# Altium schematic sheet cell_level_protection.SchDoc
size 420 x 297 mm
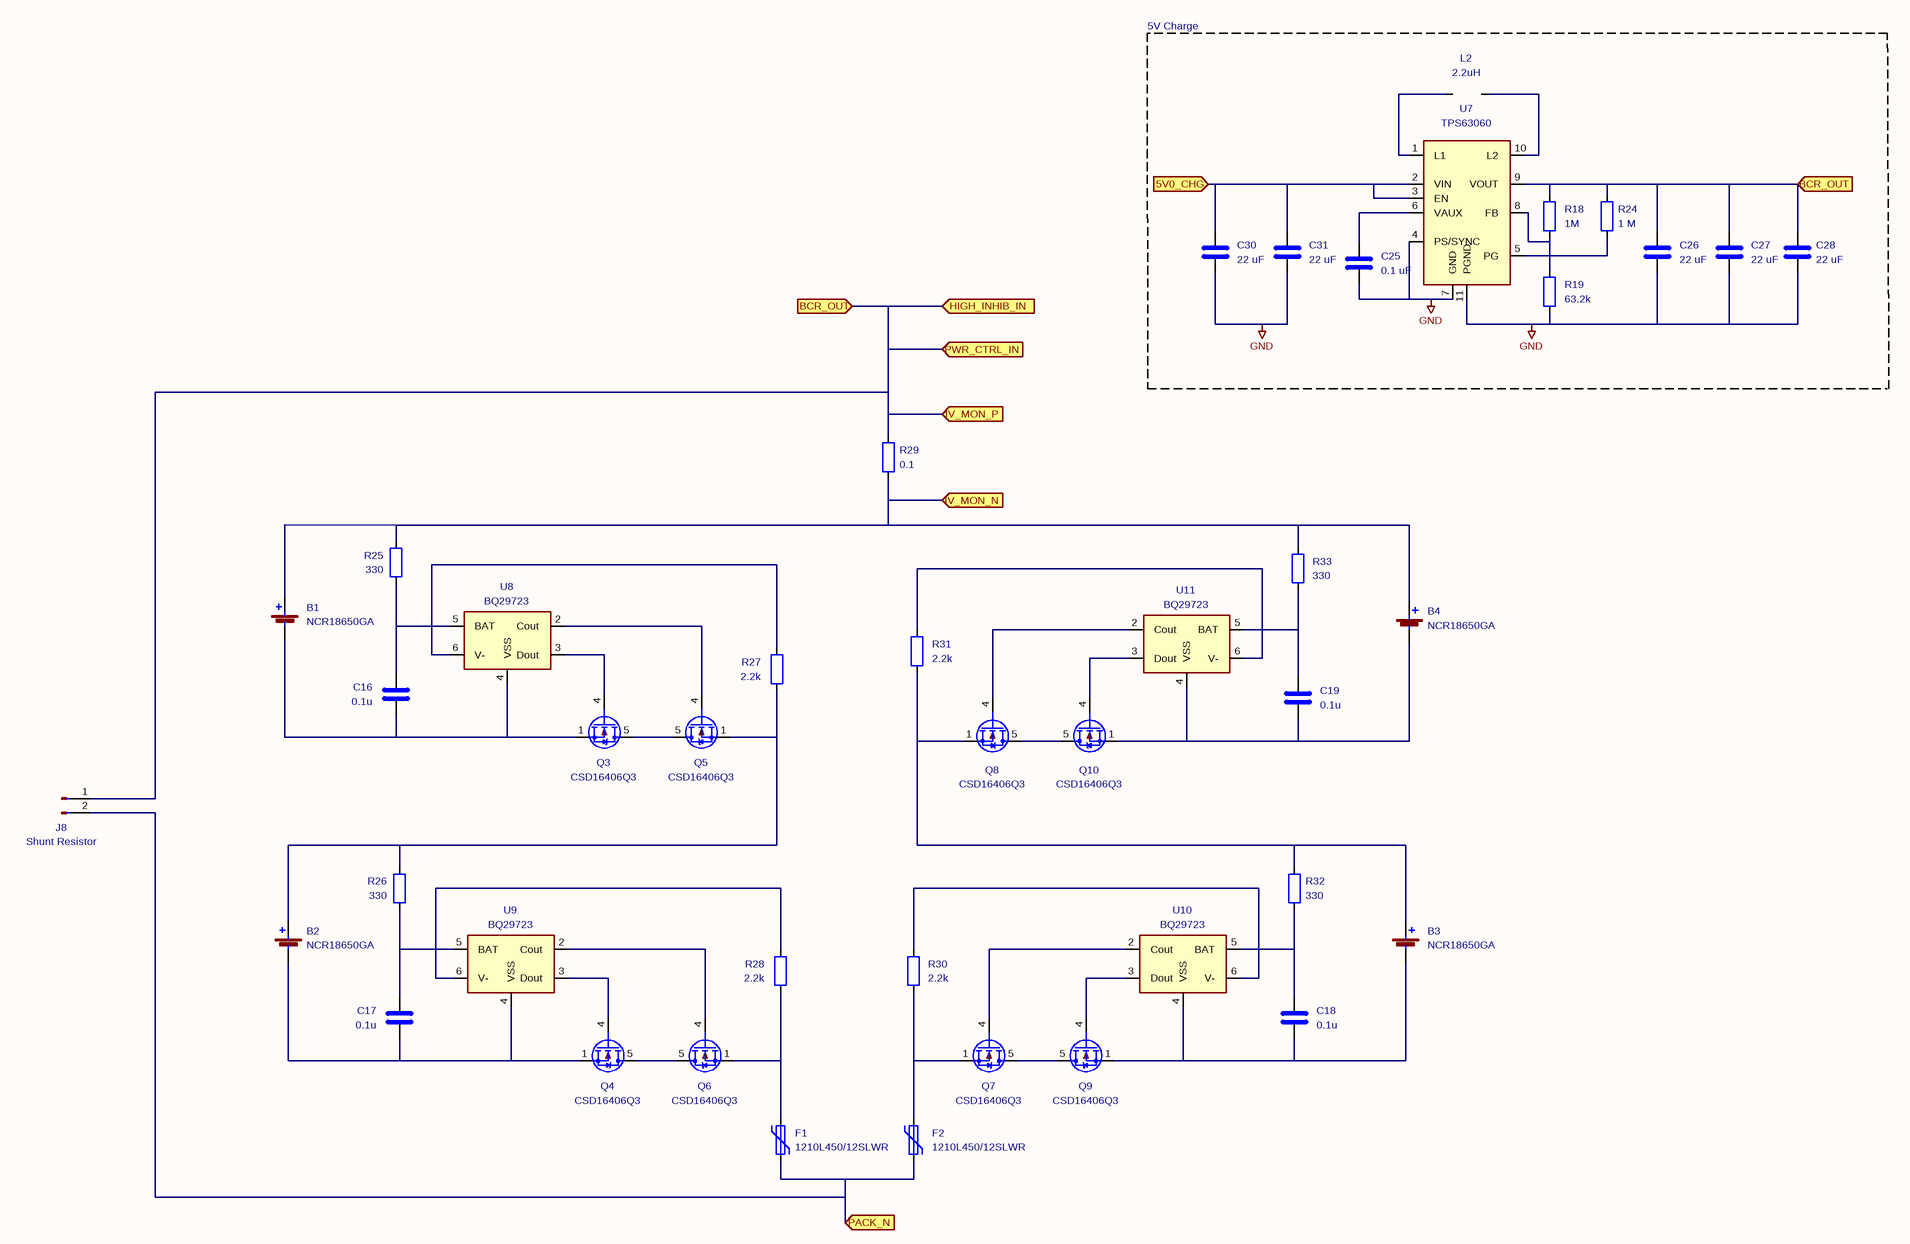
[diagram p0: cell_level_protection.SchDoc]

## Parts
B1  NCR18650GA  [Keystone_54_18650]
B2  NCR18650GA  [Keystone_54_18650]
B3  NCR18650GA  [Keystone_54_18650]
B4  NCR18650GA  [Keystone_54_18650]
C16  0.1u  [C_0603_1608Metric]
C17  0.1u  [C_0603_1608Metric]
C18  0.1u  [C_0603_1608Metric]
C19  0.1u  [C_0603_1608Metric]
C25  0.1 uF  [C_0603_1608Metric]
C26  22 uF  [C_0603_1608Metric]
C27  22 uF  [C_0603_1608Metric]
C28  22 uF  [C_0603_1608Metric]
C30  22 uF  [C_0603_1608Metric]
C31  22 uF  [C_0603_1608Metric]
F1  1210L450/12SLWR  [1210L450-polyfuse]
F2  1210L450/12SLWR  [1210L450-polyfuse]
J8  Shunt Resistor  [PinHeader_1x02_P2.00mm_Vertical]
L2  2.2uH  [L_0805_2012Metric_Pad1.15x1.40mm_HandSolder]
Q3  CSD16406Q3  [TDSON-8-1]
Q4  CSD16406Q3  [TDSON-8-1]
Q5  CSD16406Q3  [TDSON-8-1]
Q6  CSD16406Q3  [TDSON-8-1]
Q7  CSD16406Q3  [TDSON-8-1]
Q8  CSD16406Q3  [TDSON-8-1]
Q9  CSD16406Q3  [TDSON-8-1]
Q10  CSD16406Q3  [TDSON-8-1]
R18  1M  [R_0603_1608Metric]
R19  63.2k  [R_0603_1608Metric]
R24  1 M  [R_0603_1608Metric]
R25  330  [R_0603_1608Metric]
R26  330  [R_0603_1608Metric]
R27  2.2k  [R_0603_1608Metric]
R28  2.2k  [R_0603_1608Metric]
R29  0.1  [R_0603_1608Metric]
R30  2.2k  [R_0603_1608Metric]
R31  2.2k  [R_0603_1608Metric]
R32  330  [R_0603_1608Metric]
R33  330  [R_0603_1608Metric]
U7  TPS63060  [Texas_S-PWSON-N10_ThermalVias]
U8  BQ29723  [WSON-6_1.5x1.5mm_P0.5mm]
U9  BQ29723  [WSON-6_1.5x1.5mm_P0.5mm]
U10  BQ29723  [WSON-6_1.5x1.5mm_P0.5mm]
U11  BQ29723  [WSON-6_1.5x1.5mm_P0.5mm]

## Blocks framed on the sheet
5V Charge: C25-C28 C30 C31 L2 R18 R19 R24 U7

## Ports
5V0_CHG (in), BCR_OUT (in), HIGH_INHIB_IN (in), IV_MON_N (in), IV_MON_P (in), PACK_N (in), PWR_CTRL_IN (in)

## Nets
GND: C25.2 C26.2 C27.2 C28.2 C30.2 C31.2 R19.2 U7.4(PS/SYNC) U7.7(GND) U7.11(PGND)
5V0_CHG: C30.1 C31.1 U7.2(VIN) U7.3(EN) ; port 5V0_CHG
BCR_OUT: C26.1 C27.1 C28.1 J8.1(Pin_1) R18.1 R24.1 R29.1 U7.9(VOUT) ; port BCR_OUT, port IV_MON_P, port PWR_CTRL_IN, port HIGH_INHIB_IN
IV_MON_N: B1.1(+) B4.1(+) R25.1 R29.2 R33.1 ; port IV_MON_N
PACK_N: F1.2 F2.2 J8.2(Pin_2) ; port PACK_N
NetB1_2: B1.2(-) C16.1 Q3.1(S) U8.4(VSS)
NetB2_1: B2.1(+) Q5.1(S) R26.1 R27.2
NetB2_2: B2.2(-) C17.1 Q4.1(S) U9.4(VSS)
NetB3_1: B3.1(+) Q8.1(S) R31.2 R32.1
NetB3_2: B3.2(-) C18.1 Q9.1(S) U10.4(VSS)
NetB4_2: B4.2(-) C19.1 Q10.1(S) U11.4(VSS)
NetC16_2: C16.2 R25.2 U8.5(BAT)
NetC17_2: C17.2 R26.2 U9.5(BAT)
NetC18_2: C18.2 R32.2 U10.5(BAT)
NetC19_2: C19.2 R33.2 U11.5(BAT)
NetC25_1: C25.1 U7.6(VAUX)
NetF1_1: F1.1 Q6.1(S) R28.2
NetF2_1: F2.1 Q7.1(S) R30.2
NetL2_1: L2.1 U7.1(L1)
NetL2_2: L2.2 U7.10(L2)
NetQ3_4: Q3.4(G) U8.3(Dout)
NetQ3_5: Q3.5(D) Q5.5(D)
NetQ4_4: Q4.4(G) U9.3(Dout)
NetQ4_5: Q4.5(D) Q6.5(D)
NetQ5_4: Q5.4(G) U8.2(Cout)
NetQ6_4: Q6.4(G) U9.2(Cout)
NetQ7_4: Q7.4(G) U10.2(Cout)
NetQ7_5: Q7.5(D) Q9.5(D)
NetQ8_4: Q8.4(G) U11.2(Cout)
NetQ8_5: Q8.5(D) Q10.5(D)
NetQ9_4: Q9.4(G) U10.3(Dout)
NetQ10_4: Q10.4(G) U11.3(Dout)
NetR18_2: R18.2 R19.1 U7.8(FB)
NetR24_2: R24.2 U7.5(PG)
NetR27_1: R27.1 U8.6(V-)
NetR28_1: R28.1 U9.6(V-)
NetR30_1: R30.1 U10.6(V-)
NetR31_1: R31.1 U11.6(V-)

Not connected (* = marked no-connect by the designer): Q3 2(S) 3(S); Q4 2(S) 3(S); Q5 2(S) 3(S); Q6 2(S) 3(S); Q7 2(S) 3(S); Q8 2(S) 3(S); Q9 2(S) 3(S); Q10 2(S) 3(S); U8 1(NC); U9 1(NC); U10 1(NC); U11 1(NC)

## Notes on the sheet
- 1
- 2
- 3
- 4
- 5
- 6
- 7
- 8
- A
- B
- C
- D
- E
- Title:
- File: cell_level_protection.kicad_sch
- Sheet: /
- F
- KiCad E.D.A.  kicad (5.1.4)-1
- Size: A3
- Date:
- Rev:
- Id: 1/1

## Library data of the parts
B1-B4 = Battery_Cell: Value: NCR18650GA; Footprint: qset-footprints:Keystone_54_18650
C16-C19 C25-C28 C30 C31 = C: Footprint: Capacitor_SMD:C_0603_1608Metric
  C16-C19: Value: 0.1u
  C25: Value: 0.1 uF
  C26-C28 C30 C31: Value: 22 uF
F1 F2 = Polyfuse: Value: 1210L450/12SLWR; Footprint: qset-footprints:1210L450-polyfuse
J8 = Conn_01x02_Male: Value: Shunt Resistor; Footprint: Connector_PinHeader_2.00mm:PinHeader_1x02_P2.00mm_Vertical
L2 = L: Value: 2.2uH; Footprint: Inductor_SMD:L_0805_2012Metric_Pad1.15x1.40mm_HandSolder
Q3-Q10 = CSD16401Q5: Value: CSD16406Q3; Footprint: Package_TO_SOT_SMD:TDSON-8-1
R18 R19 R24-R33 = R: Footprint: Resistor_SMD:R_0603_1608Metric
  R18: Value: 1M
  R19: Value: 63.2k
  R24: Value: 1 M
  R25 R26 R32 R33: Value: 330
  R27 R28 R30 R31: Value: 2.2k
  R29: Value: 0.1
U8-U11 = BQ297xy: Value: BQ29723; Footprint: Package_SON:WSON-6_1.5x1.5mm_P0.5mm
U7 = TPS63060: Value: TPS63060; Footprint: Package_SON:Texas_S-PWSON-N10_ThermalVias